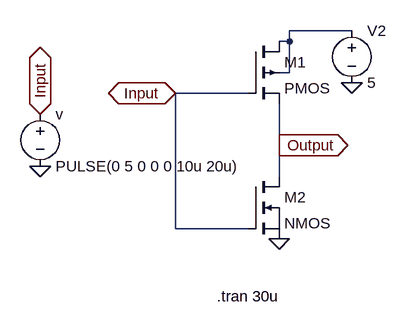
[diagram p0: schematic Draft4.asc]
Draft4.asc, the LTspice schematic file:
Version 4
SHEET 1 880 680
WIRE 528 96 432 96
WIRE 432 112 432 96
WIRE 432 112 416 112
WIRE 432 160 432 112
WIRE 432 160 416 160
WIRE 368 192 256 192
WIRE 416 272 416 208
WIRE 416 320 416 272
WIRE 256 400 256 192
WIRE 368 400 256 400
FLAG 416 416 0
FLAG 48 304 0
FLAG 48 224 Input
IOPIN 48 224 BiDir
FLAG 256 192 Input
IOPIN 256 192 BiDir
FLAG 416 272 Output
IOPIN 416 272 Out
FLAG 528 176 0
SYMBOL Voltage 48 208 R0
SYMATTR InstName v
SYMATTR Value PULSE(0 5 0 0 0 10u 20u)
SYMBOL Voltage 528 80 R0
SYMATTR InstName V2
SYMATTR Value 5
SYMBOL pmos4 368 112 R0
SYMATTR InstName M1
SYMBOL nmos 368 320 R0
SYMATTR InstName M2
TEXT 320 504 Left 2 !.tran 30u

The netlist it stands for:
* Draft4.asc
v Input 0 PULSE(0 5 0 0 0 10u 20u)
V2 N001 0 5
M1 N001 Input Output N001 PMOS
M2 Output Input 0 0 NMOS
.model NMOS NMOS
.model PMOS PMOS
.lib standard.mos
.tran 30u
.backanno
.end